# EAGLE design DLS_1_0 (EAGLE 8.3.2)
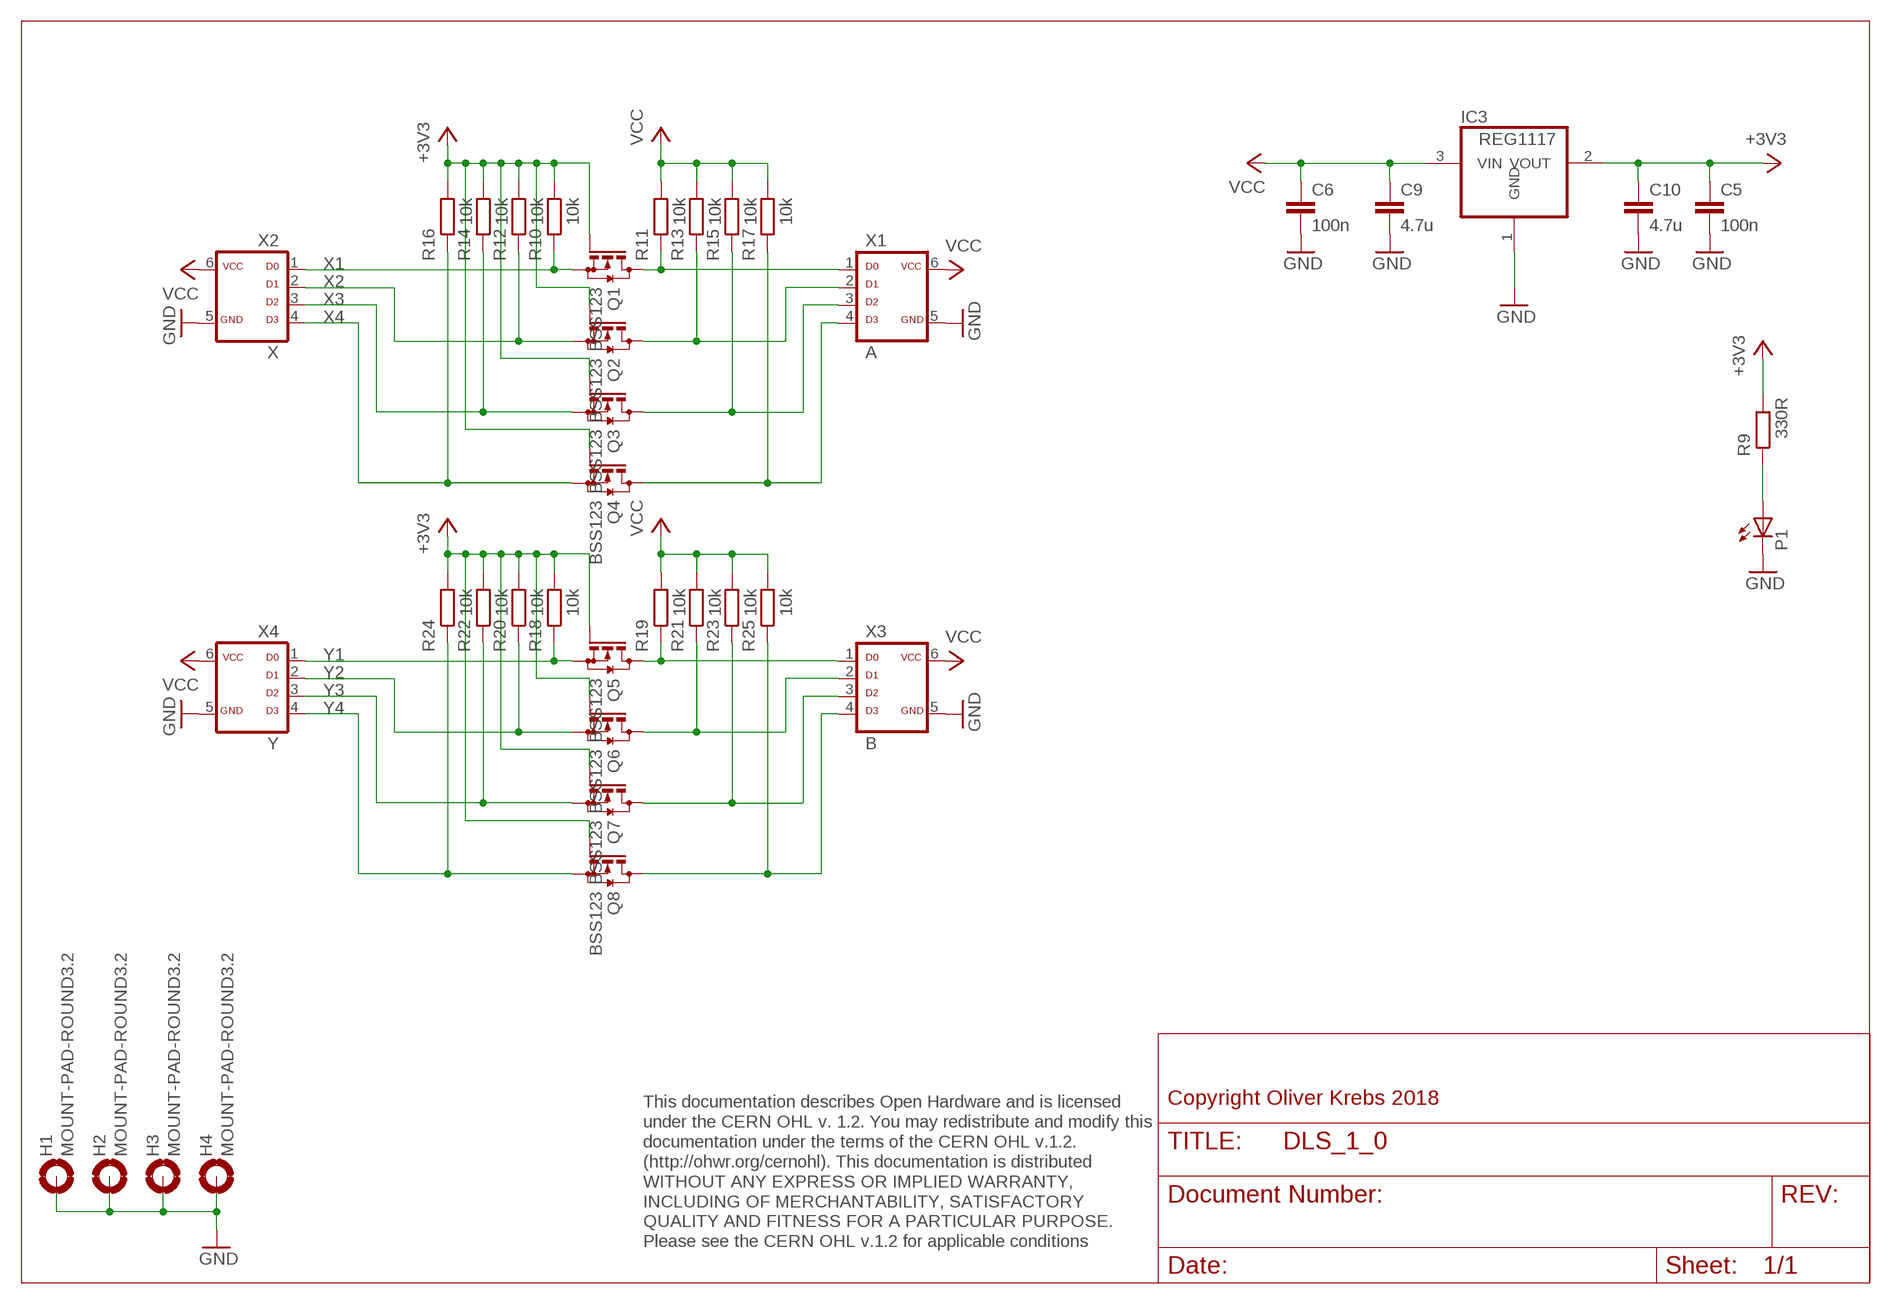
[diagram p0: schematic, sheet 1]

## Parts
C5  100n  C-EUC0603  [C0603]
C6  100n  C-EUC0603  [C0603]
C9  4.7u  C-EUC0805K  [C0805K]
C10  4.7u  C-EUC0805K  [C0805K]
H1  MOUNT-PAD-ROUND3.2  [3,2-PAD]
H2  MOUNT-PAD-ROUND3.2  [3,2-PAD]
H3  MOUNT-PAD-ROUND3.2  [3,2-PAD]
H4  MOUNT-PAD-ROUND3.2  [3,2-PAD]
IC3  REG1117  [SOT223]
P1  LEDCHIPLED_1206  [CHIPLED_1206]
Q1  BSS123  [SOT23]
Q2  BSS123  [SOT23]
Q3  BSS123  [SOT23]
Q4  BSS123  [SOT23]
Q5  BSS123  [SOT23]
Q6  BSS123  [SOT23]
Q7  BSS123  [SOT23]
Q8  BSS123  [SOT23]
R9  330R  R-EU_R0402  [R0402]
R10  10k  R-EU_R0402  [R0402]
R11  10k  R-EU_R0402  [R0402]
R12  10k  R-EU_R0402  [R0402]
R13  10k  R-EU_R0402  [R0402]
R14  10k  R-EU_R0402  [R0402]
R15  10k  R-EU_R0402  [R0402]
R16  10k  R-EU_R0402  [R0402]
R17  10k  R-EU_R0402  [R0402]
R18  10k  R-EU_R0402  [R0402]
R19  10k  R-EU_R0402  [R0402]
R20  10k  R-EU_R0402  [R0402]
R21  10k  R-EU_R0402  [R0402]
R22  10k  R-EU_R0402  [R0402]
R23  10k  R-EU_R0402  [R0402]
R24  10k  R-EU_R0402  [R0402]
R25  10k  R-EU_R0402  [R0402]
X1  A  ML6D  [ML-6]
X2  X  ML6D  [ML-6]
X3  B  ML6D  [ML-6]
X4  Y  ML6D  [ML-6]

## Nets
+3V3: C5.1 C10.1 IC3.2(VOUT) Q1.1(G) Q2.1(G) Q3.1(G) Q4.1(G) Q5.1(G) Q6.1(G) Q7.1(G) Q8.1(G) R9.2 R10.2 R12.2 R14.2 R16.2 R18.2 R20.2 R22.2 R24.2
GND: C5.2 C6.2 C9.2 C10.2 H1.B3,2(MOUNT) H2.B3,2(MOUNT) H3.B3,2(MOUNT) H4.B3,2(MOUNT) IC3.1(GND) P1.C X1.5 X2.5 X3.5 X4.5
N$2: Q1.3(D) R11.1 X1.1
N$6: Q5.3(D) R19.1 X3.1
N$8: Q2.3(D) R13.1 X1.2
N$10: Q3.3(D) R15.1 X1.3
N$12: Q4.3(D) R17.1 X1.4
N$14: Q6.3(D) R21.1 X3.2
N$16: Q7.3(D) R23.1 X3.3
N$18: Q8.3(D) R25.1 X3.4
N$25: P1.A R9.1
VCC: C6.1 C9.1 IC3.3(VIN) R11.2 R13.2 R15.2 R17.2 R19.2 R21.2 R23.2 R25.2 X1.6 X2.6 X3.6 X4.6
X1: Q1.2(S) R10.1 X2.1
X2: Q2.2(S) R12.1 X2.2
X3: Q3.2(S) R14.1 X2.3
X4: Q4.2(S) R16.1 X2.4
Y1: Q5.2(S) R18.1 X4.1
Y2: Q6.2(S) R20.1 X4.2
Y3: Q7.2(S) R22.1 X4.3
Y4: Q8.2(S) R24.1 X4.4

## Notes on the sheet
- Copyright Oliver Krebs 2018
- This documentation describes Open Hardware and is licensed 
  under the CERN OHL v. 1.2. You may redistribute and modify this 
  documentation under the terms of the CERN OHL v.1.2. 
  (http://ohwr.org/cernohl). This documentation is distributed
  WITHOUT ANY EXPRESS OR IMPLIED WARRANTY, 
  INCLUDING OF MERCHANTABILITY, SATISFACTORY 
  QUALITY AND FITNESS FOR A PARTICULAR PURPOSE. 
  Please see the CERN OHL v.1.2 for applicable conditions

## Library data of the parts
C5 C6 C9 C10 = 01-my_rcl:C-EU: CAPACITOR, European symbol
H1-H4 = holes:MOUNT-PAD-ROUND: MOUNTING PAD, round
IC3 = burr-brown:REG1117: 800mA and 1A Low Dropout (LDO) Positive Regulator 1.8V, 2.5V, 2.85V, 3.3V, 5V, and Adj; MPN: REG1117; OC_FARNELL: 1097566; OC_NEWARK: 14P6981
P1 = 01-my-led:LED: LED OSRAM: - CHIPLED LG R971, LG N971, LY N971, LG Q971, LY Q971, LO R971, LY R971 LH N974, LH R974 LS Q976, LO Q976, LY Q976 LO Q996 - Hyper CHIPLED LW Q18S LB Q993, LB Q99A, LB R99A - SideLED LS A670, LO A670, LY A670, LG A670, LP A670 LB A673, LV A673, LT A673, LW A673 LH A674 LY A675 LS A676, LA A676, LO A676, LY A676, LW A676 LS A679, LY A679, LG A679 - Hyper Micro SIDELED® LS Y876, LA Y876, LO Y876, LY Y876 LT Y87S - SmartLED LW L88C, LW L88S LB L89C, LB L89S, LG L890 LS L89K, LO L89K, LY L89K LS L896, LA L896, LO L896, LY L896 - TOPLED LS T670, LO T670, LY T670, LG T670, LP T670 LSG T670, LSP T670, LSY T670, LOP T670, LYG T670 LG T671, LOG T671, LSG T671 LB T673, LV T673, LT T673, LW T673 LH T674 LS T676, LA T676, LO T676, LY T676, LB T676, LH T676, LSB T676, LW T676 LB T67C, LV T67C, LT T67C, LS T67K, LO T67K, LY T67K, LW E67C LS E67B, LA E67B, LO E67B, LY E67B, LB E67C, LV E67C, LT E67C LW T67C LS T679, LY T679, LG T679 LS T770, LO T770, LY T770, LG T770, LP T770 LB T773, LV T773, LT T773, LW T773 LH T774 LS E675, LA E675, LY E675, LS T675 LS T776, LA T776, LO T776, LY T776, LB T776 LHGB T686 LT T68C, LB T68C - Hyper Mini TOPLED® LB M676 - Mini TOPLED Santana® LG M470 LS M47K, LO M47K, LY M47K Source: http://www.osram.convergy.de LUXEON: - LUMILED® LXK2-PW12-R00, LXK2-PW12-S00, LXK2-PW14-U00, LXK2-PW14-V00 LXK2-PM12-R00, LXK2-PM12-S00, LXK2-PM14-U00 LXK2-PE12-Q00, LXK2-PE12-R00, LXK2-PE12-S00, LXK2-PE14-T00, LXK2-PE14-U00 LXK2-PB12-K00, LXK2-PB12-L00, LXK2-PB12-M00, LXK2-PB14-N00, LXK2-PB14-P00, LXK2-PB14-Q00 LXK2-PR12-L00, LXK2-PR12-M00, LXK2-PR14-Q00, LXK2-PR14-R00 LXK2-PD12-Q00, LXK2-PD12-R00, LXK2-PD12-S00 LXK2-PH12-R00, LXK2-PH12-S00 LXK2-PL12-P00, LXK2-PL12-Q00, LXK2-PL12-R00 Source: www.luxeon.com KINGBRIGHT: KA-3528ASYC Source: www.kingbright.com
Q1-Q8 = 01-my-transistor:BSS123: N-CHANNEL MOS FET
R9-R25 = 01-my_rcl:R-EU_: RESISTOR, European symbol
X1-X4 = 01-my-con:ML6D

## Board
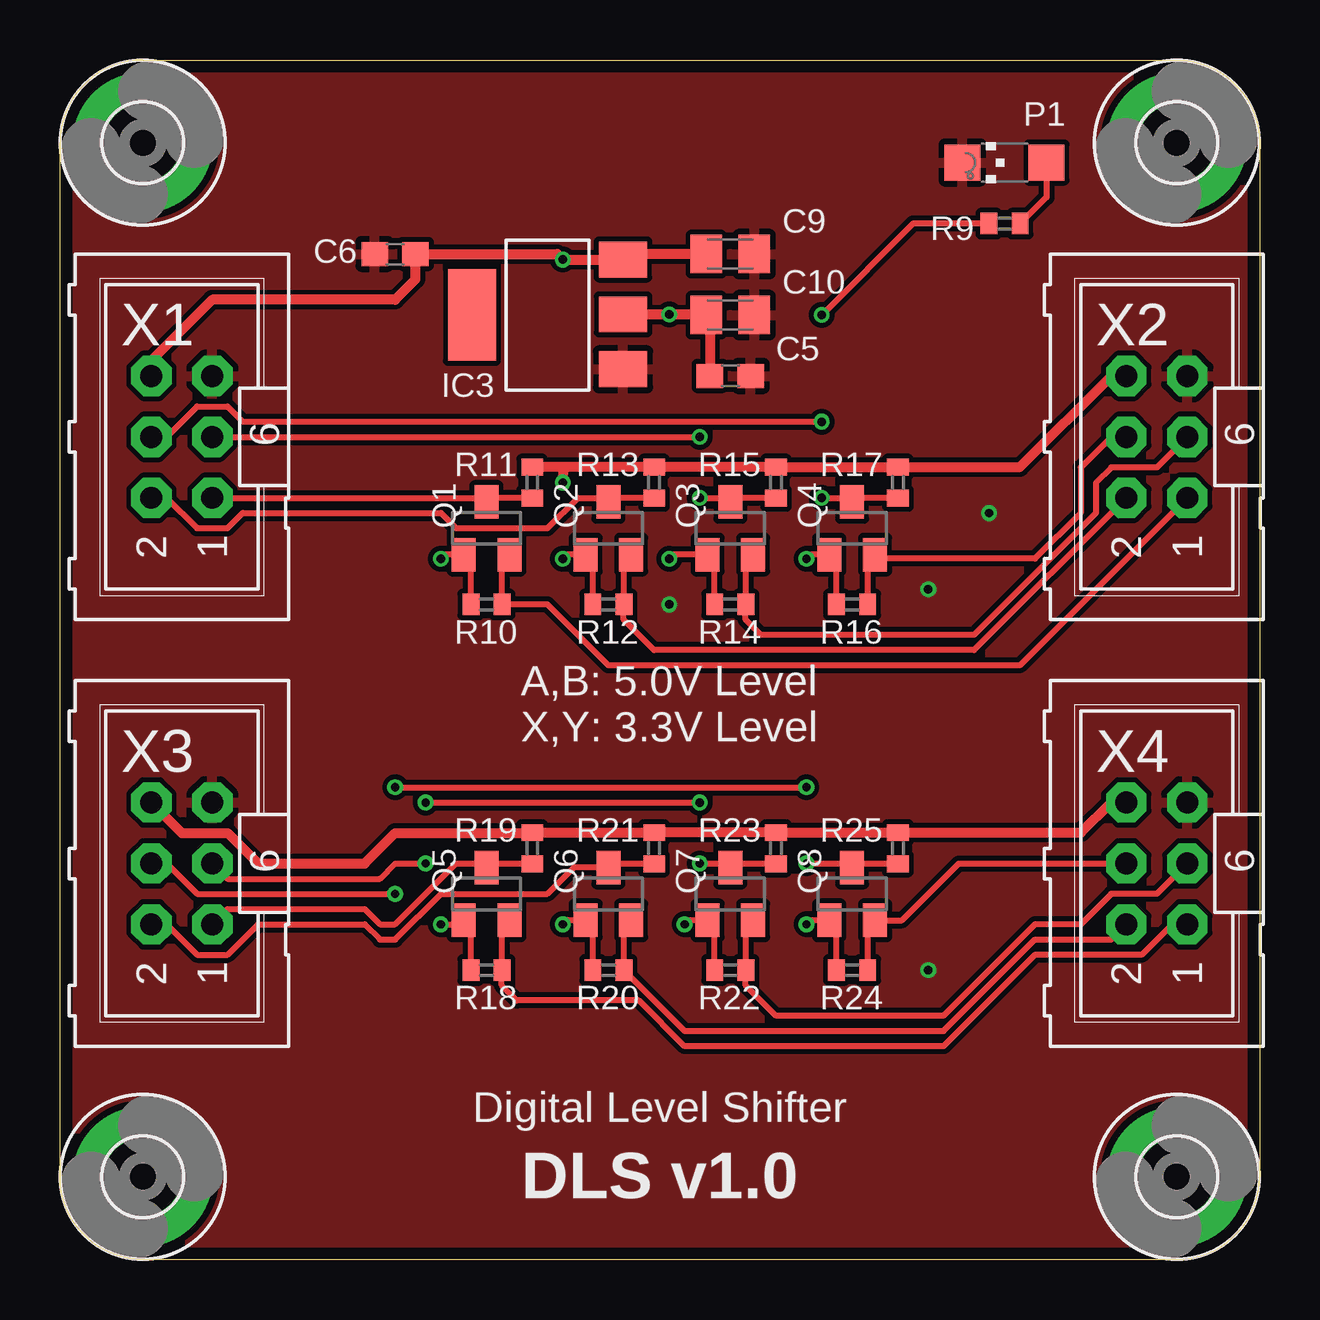
[diagram p1: board, top side]
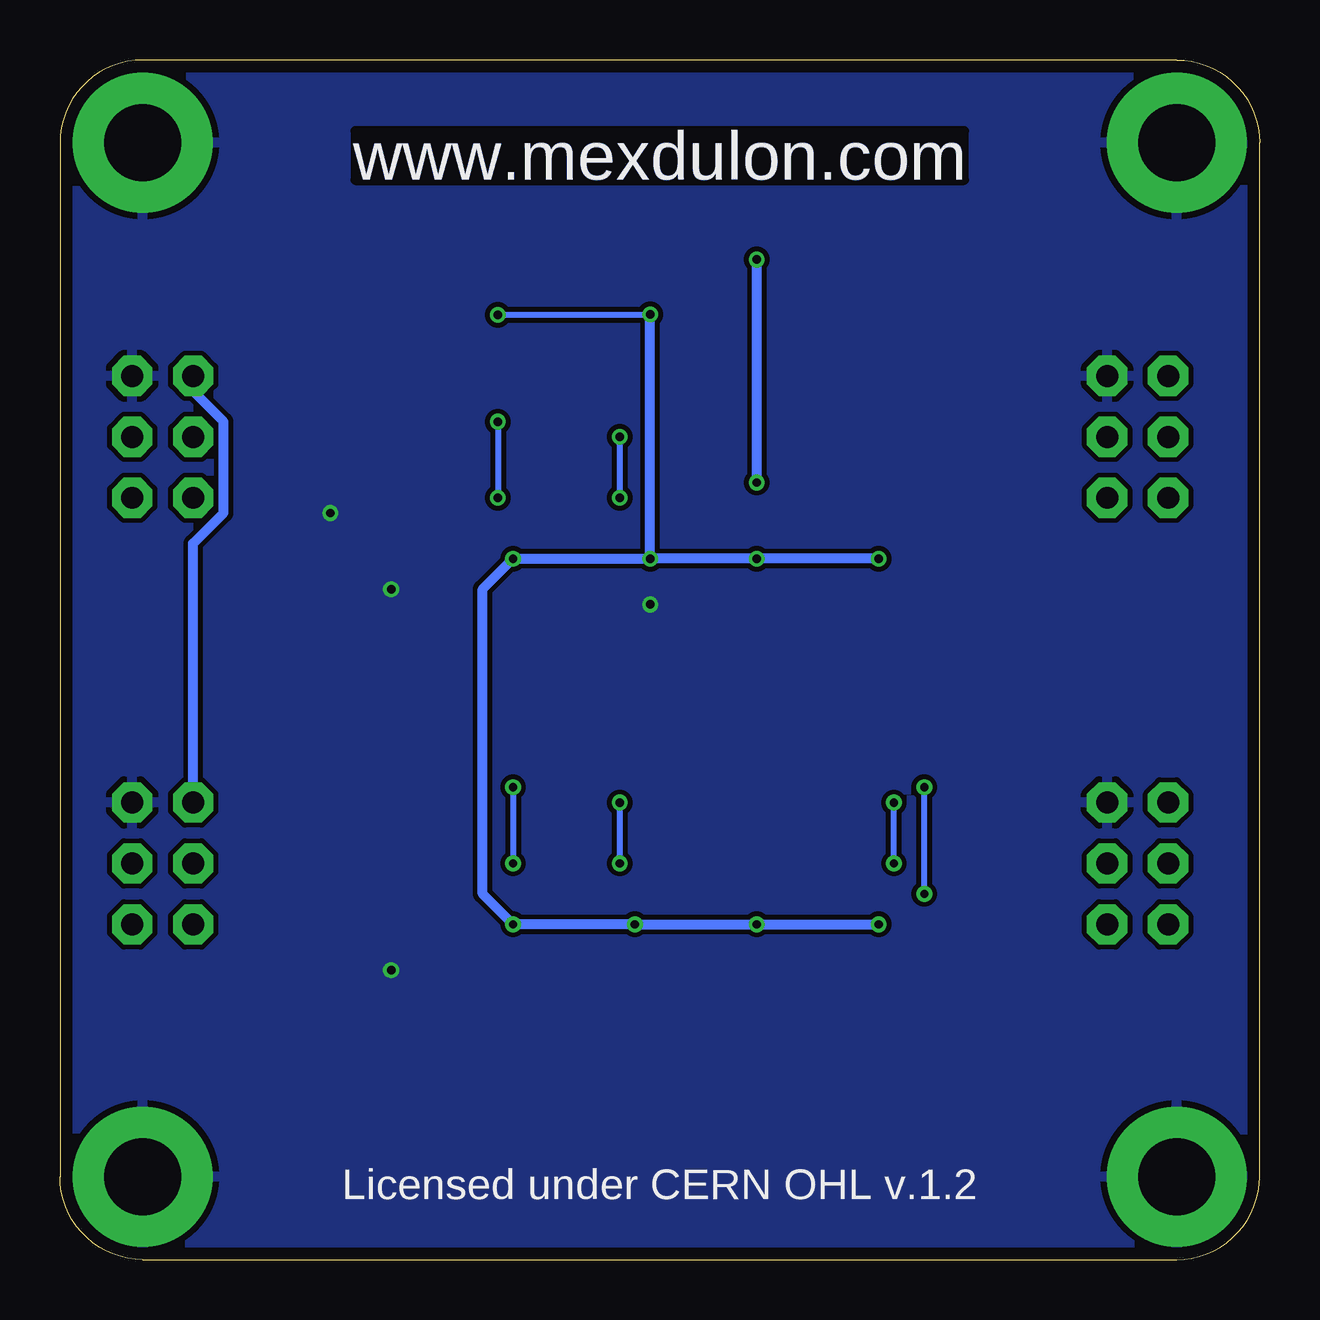
[diagram p2: board, bottom side, seen from below]

Size 50 x 50 mm. Coordinates in mm from the lower left corner, seen from the top.
Outline: 0,3.45 0,46.55 arc-90 3.45,50 46.55,50 arc-90 50,46.55 50,3.45 arc-90 46.55,0 3.45,0 arc-90 0,3.45
Copper layers (1*16): Top 0.035mm / dielectric 1.6mm / Bottom 0.035mm
Design rules "Elecrow_2-layer_PCB_eagle_rule": minimum track width 6mil, minimum drill 12mil, track to track 6mil, track to pad 6mil, pad to pad 6mil, via to via 8mil, smd to smd 0mil, copper to edge 20mil, drill to drill 10mil, minimum pad ring 6mil, minimum via ring 6mil, stop-mask expansion 0mil, vias tented up to drill 100mil, thermal gap 10mil

### Footprints (pad centres in the part's own frame; a part is rotated, then mirrored left to right if it is on the bottom)
C0603 = smd 1.1 x 1: 1 -0.85,0; 2 0.85,0
C0805K = smd 1.3 x 1.6: 1 -1,0; 2 1,0
3,2-PAD = drill 3.2 pad 5.842: B3,2 0,0
SOT223 = smd 1.499 x 2.007: 1 -2.261,-3.15; 2 0.025,-3.15; 3 2.311,-3.15 | smd 3.81 x 2.007: 4 0,3.15
CHIPLED_1206 = smd 1.5 x 1.5: A 0,-1.75; C 0,1.75
SOT23 = smd 1 x 1.4: 1 -0.95,-1.1; 2 0.95,-1.1; 3 0,1.1
R0402 = smd 0.7 x 0.9: 1 -0.65,0; 2 0.65,0
ML-6 = drill 0.914 pad 1.676 octagon: 1 -2.54,-1.27; 2 -2.54,1.27; 3 0,-1.27; 4 0,1.27; 5 2.54,-1.27; 6 2.54,1.27

### Placement (x,y rotation side)
C5  27.94,36.83 0 top
C6  13.97,41.91 180 top
C9  27.94,41.91 0 top
C10  27.94,39.37 0 top
H1  3.45,3.45 0 top
H2  3.45,46.55 0 top
H3  46.55,46.55 0 top
H4  46.55,3.45 0 top
IC3  20.32,39.37 90 top
P1  39.37,45.72 90 top
Q1  17.78,30.48 0 top
Q2  22.86,30.48 0 top
Q3  27.94,30.48 0 top
Q4  33.02,30.48 0 top
Q5  17.78,15.24 0 top
Q6  22.86,15.24 0 top
Q7  27.94,15.24 0 top
Q8  33.02,15.24 0 top
R9  39.37,43.18 180 top
R10  17.78,27.3 180 top
R11  19.68,32.38 90 top
R12  22.86,27.3 180 top
R13  24.77,32.38 90 top
R14  27.94,27.3 180 top
R15  29.84,32.38 90 top
R16  33.02,27.3 180 top
R17  34.92,32.38 90 top
R18  17.78,12.06 180 top
R19  19.68,17.14 90 top
R20  22.86,12.06 180 top
R21  24.77,17.14 90 top
R22  27.94,12.06 180 top
R23  29.84,17.14 90 top
R24  33.02,12.06 180 top
R25  34.92,17.14 90 top
X1  5.08,34.29 90 top
X2  45.72,34.29 90 top
X3  5.08,16.51 90 top
X4  45.72,16.51 90 top

### Tracks (layer width: path | path; a pad name or v marks a point on that pad's centre or on a via)
+3V3  (via drill 0.35)
  Top 0.254: R18.2 17.13,13.84 Q5.1 16.66,13.97 v15.88,13.97 | R20.2 22.21,13.84 Q6.1 21.12,14.14 v20.95,13.97 | R22.2 27.29,13.84 Q7.1 26.2,14.14 v26.04,13.97 | R24.2 32.37,13.84 Q8.1 31.29,14.14 v31.11,13.97 | R10.2 17.13,29.08 Q1.1 16.05,29.38 v15.88,29.21 | R12.2 22.21,29.08 Q2.1 21.12,29.38 v20.95,29.21 | R14.2 27.29,29.08 Q3.1 25.57,29.38 v25.4,29.21 | R16.2 32.37,29.08 Q4.1 31.29,29.38 v31.11,29.21 | 26.91,39.4 C10.1 27.09,39.22 | R9.2 35.56,43.18 v31.75,39.37
  Top 0.406: 26.91,39.4 v25.4,39.4 IC3.2 | 27.09,39.22 C5.1
  Bottom 0.254: 25.43,39.37 v31.75,39.37 | 25.43,39.37 v25.4,39.4 | 25.4,39.34 25.43,39.37
  Bottom 0.406: v25.4,29.21 25.4,39.34 | v25.4,29.21 v31.11,29.21 32.38,27.94 32.38,15.24 v31.11,13.97 v26.04,13.97 v20.95,13.97 v15.88,13.97 | v25.4,29.21 v20.95,29.21 v15.88,29.21
GND  (via drill 0.35)
  other vias: 36.2,12.06 38.73,31.11 36.2,27.94 25.4,27.3
  pour Bottom (isolate 0.203): 0,50.16 50.8,50.16 50.8,0 0,0
  pour Top (isolate 0.203): 0,50.16 50.8,50.16 50.8,0 0,0
N$2
  Top 0.254: R11.1 17.93,31.73 Q1.3 17.61,31.75 X1.1
N$6
  Top 0.254: R19.1 17.93,16.5 Q5.3 17.61,16.51 16.51,16.51 13.97,13.97 13.34,13.97 12.7,14.61 6.99,14.61 X3.1
N$8
  Top 0.254: R13.1 23.02,31.73 Q2.3 22.69,31.75 21.59,31.75 20.32,30.48 16.51,30.48 15.88,31.11 7.62,31.11 6.99,30.48 5.71,30.48 4.45,31.75 X1.2
N$10  (via drill 0.35)
  Top 0.254: R15.1 28.09,31.73 Q3.3 27.77,31.75 v26.67,31.75 | X1.3 v26.67,34.29
  Bottom 0.254: v26.67,34.29 v26.67,31.75
N$12  (via drill 0.35)
  Top 0.254: R17.1 33.17,31.73 33.1,31.66 | 33.1,31.66 Q4.3 | X1.4 4.45,34.29 5.71,35.56 6.99,35.56 7.62,34.92 v31.75,34.92 | v31.75,31.75 33.02,31.75 33.1,31.66
  Bottom 0.254: v31.75,34.92 v31.75,31.75
N$14
  Top 0.254: R21.1 23.02,16.5 Q6.3 | 22.69,16.51 Q6.3 | Q6.3 21.42,16.34 20.32,15.24 15.88,15.24 13.97,13.34 13.34,13.34 12.7,13.97 8.26,13.97 6.99,12.7 5.71,12.7 4.45,13.97 X3.2
N$16  (via drill 0.35)
  Top 0.254: R23.1 28.09,16.5 Q7.3 27.77,16.51 v26.67,16.51 | v15.24,19.05 v26.67,19.05 | X3.3 6.99,15.88 13.34,15.88 13.97,16.51 v15.24,16.51
  Bottom 0.254: v15.24,16.51 v15.24,19.05 | v26.67,19.05 v26.67,16.51
N$18  (via drill 0.35)
  Top 0.254: R25.1 33.17,16.5 Q8.3 32.85,16.51 v31.11,16.51 | X3.4 4.45,16.51 5.71,15.24 v13.97,15.24 | v13.97,19.68 v31.11,19.68
  Bottom 0.254: v13.97,15.24 v13.97,19.68 | v31.11,19.68 v31.11,16.51
N$25
  Top 0.254: P1.A 41.12,44.28 R9.1
VCC  (via drill 0.35)
  Top 0.254: R19.2 | 15.05,41.68 C6.1 | 23.7,41.91 IC3.3
  Top 0.406: 20.97,33.03 R13.2 R15.2 R17.2 40.02,33.03 43.81,36.83 X2.6 | 20.97,33.03 R11.2 | R19.2 R21.2 R23.2 R25.2 42.56,17.8 43.81,19.05 X4.6 | X3.6 5.08,17.78 6.99,17.78 8.26,16.51 12.7,16.51 13.97,17.78 R19.2 | X1.6 3.81,37.47 6.35,40.01 13.97,40.01 14.82,40.85 C6.1 20.73,41.91 v20.95,41.68 IC3.3 | C9.1 23.7,41.91 | 20.97,33.03 v20.95,32.38
  Bottom 0.406: X4.6 44.45,29.84 43.18,31.11 43.18,34.92 44.45,36.2 X2.6 | v20.95,32.38 v20.95,41.68
X1
  Top 0.254: R10.1 18.43,29.08 Q1.2 | X2.1 40.01,24.77 22.86,24.77 20.32,27.3 R10.1 | 18.41,27.29 R10.1
X2
  Top 0.254: Q2.2 23.51,29.08 R12.1 23.5,27.29 23.5,26.67 24.77,25.4 38.1,25.4 X2.2
X3
  Top 0.254: Q3.2 28.59,29.08 R14.1 28.57,27.29 28.57,26.67 29.21,26.04 38.1,26.04 43.18,31.11 43.18,32.38 43.81,33.02 45.72,33.02 X2.3
X4
  Top 0.254: R16.1 33.67,29.08 Q4.2 34.14,29.21 40.64,29.21 42.55,31.11 42.55,33.02 43.81,34.29 X2.4
Y1
  Top 0.254: Q5.2 18.43,13.84 R18.1 18.41,12.05 18.41,11.43 19.05,10.79 24.13,10.79 26.04,8.89 36.83,8.89 40.64,12.7 45.09,12.7 46.35,13.97 X4.1
Y2
  Top 0.254: X4.2 43.81,13.34 40.64,13.34 36.83,9.53 26.04,9.53 23.5,12.06 R20.1 23.51,13.84 Q6.2
Y3
  Top 0.254: X4.3 45.72,15.24 43.81,15.24 42.55,13.97 40.64,13.97 36.83,10.16 29.84,10.16 28.57,11.43 28.57,12.05 R22.1 28.59,13.84 Q7.2
Y4
  Top 0.254: X4.4 37.47,16.51 35.09,14.14 Q8.2 33.67,13.84 R24.1

### Text on the board
Bottom: www.mexdulon.com
tPlace: A,B: 5.0V Level / X,Y: 3.3V Level
tNames: Digital Level Shifter | DLS v1.0
bNames: www.mexdulon.com | Licensed under CERN OHL v.1.2